# Altium project PCB_Project1.PrjPCB
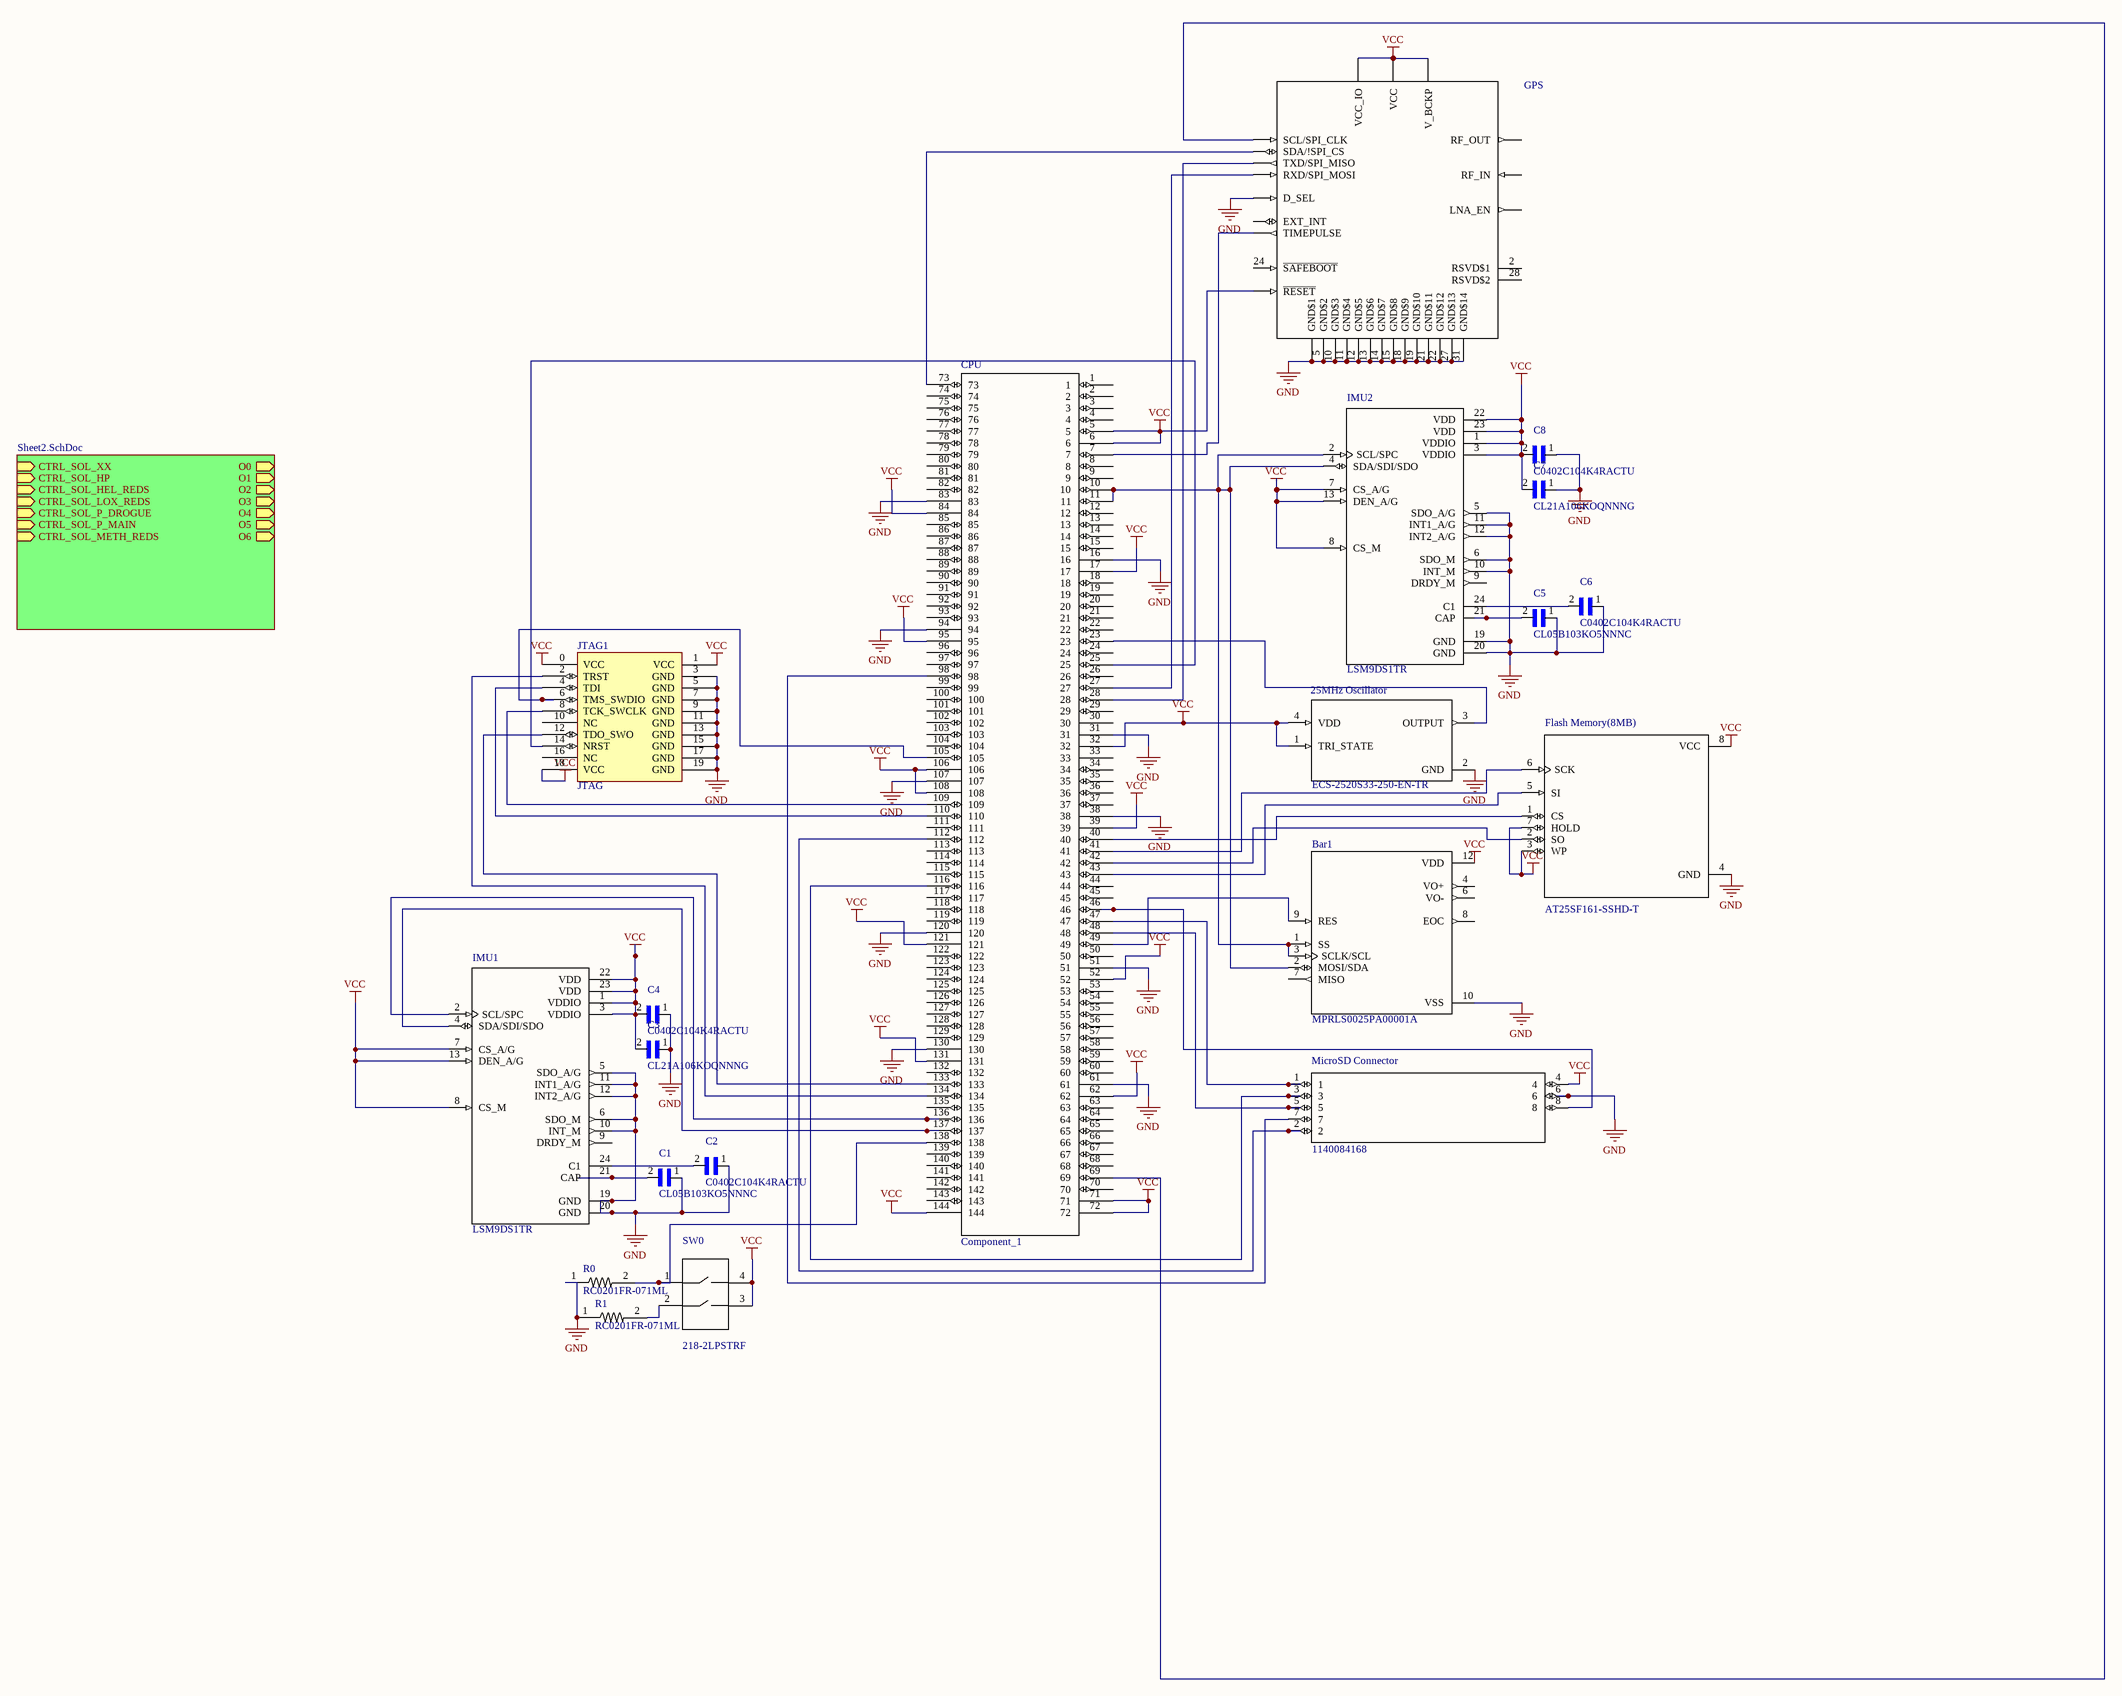
[diagram p0: Sheet1.SchDoc]
1 sheet, 20 parts. Net scope: hierarchical (ports join the sheet entries above them; power ports are global).

## Sheet Sheet1.SchDoc
size C

### Parts
25MHz_Oscillator  ECS-2520S33-250-EN-TR  [*OSC_ECS-2520S33-250-EN-TR]
Bar1  MPRLS0025PA00001A  [*XDCR_MPRLS0025PA00001A]
C1  CL05B103KO5NNNC  [*CAPC1005X55N]
C2  C0402C104K4RACTU  [*CAPC1005X60]
C3  CL21A106KOQNNNG  [*CAPC2012X140N]
C4  C0402C104K4RACTU  [*CAPC1005X60]
C5  CL05B103KO5NNNC  [*CAPC1005X55N]
C6  C0402C104K4RACTU  [*CAPC1005X60]
C7  CL21A106KOQNNNG  [*CAPC2012X140N]
C8  C0402C104K4RACTU  [*CAPC1005X60]
CPU  Component_1  [*QFP50P2200X2200X160-144N]
Flash_Memory(8MB)  AT25SF161-SSHD-T  [*SOIC127P600X175-8N]
GPS  CAM-M8  [*CAM-M8]  (value not drawn)
IMU1  LSM9DS1TR  [*PQFN43P300X350X102-24N]
IMU2  LSM9DS1TR  [*PQFN43P300X350X102-24N]
JTAG1  JTAG  [SBH11-PBPC-D10-ST-BK]
MicroSD_Connector  1140084168  [*1140084168]
R0  RC0201FR-071ML  [*RESC0603X26N]
R1  RC0201FR-071ML  [*RESC0603X26N]
SW0  218-2LPSTRF  [*SW_218-2LPSTRF]

### Sub-sheets
Sheet2.SchDoc = Sheet2.SchDoc (file not in this document): CTRL_SOL_XX (in), CTRL_SOL_HP (in), CTRL_SOL_HEL_REDS (in), CTRL_SOL_LOX_REDS (in), CTRL_SOL_P_DROGUE (in), CTRL_SOL_P_MAIN (in), CTRL_SOL_METH_REDS (in), O0 (out), O1 (out), O2 (out), O3 (out), O4 (out), O5 (out), O6 (out)

### Nets
GND: 25MHz_Oscillator.2(GND) Bar1.10(VSS) C1.1 C2.1 C3.1 C4.1 C5.1 C6.1 C7.1 C8.1 CPU.16 CPU.31 CPU.38 CPU.51 CPU.61 CPU.83 CPU.94 CPU.107 CPU.120 CPU.130 Flash_Memory(8MB).4(GND) GPS.4(GND$1) GPS.5(GND$2) GPS.10(GND$3) GPS.11(GND$4) GPS.12(GND$5) GPS.13(GND$6) GPS.14(GND$7) GPS.15(GND$8) GPS.18(GND$9) GPS.19(GND$10) GPS.20(D_SEL) GPS.21(GND$11) GPS.22(GND$12) GPS.27(GND$13) GPS.31(GND$14) IMU1.5(SDO_A/G) IMU1.6(SDO_M) IMU1.10(INT_M) IMU1.11(INT1_A/G) IMU1.12(INT2_A/G) IMU1.19(GND) IMU1.20(GND) IMU2.5(SDO_A/G) IMU2.6(SDO_M) IMU2.10(INT_M) IMU2.11(INT1_A/G) IMU2.12(INT2_A/G) IMU2.19(GND) IMU2.20(GND) JTAG1.3(GND) JTAG1.5(GND) JTAG1.7(GND) JTAG1.9(GND) JTAG1.11(GND) JTAG1.13(GND) JTAG1.15(GND) JTAG1.17(GND) JTAG1.19(GND) MicroSD_Connector.6 R0.1 R1.1
VCC: 25MHz_Oscillator.1(TRI_STATE) 25MHz_Oscillator.4(VDD) Bar1.12(VDD) C3.2 C4.2 C7.2 C8.2 CPU.5 CPU.6 CPU.17 CPU.32 CPU.39 CPU.52 CPU.62 CPU.71 CPU.72 CPU.84 CPU.95 CPU.106 CPU.108 CPU.121 CPU.131 CPU.144 Flash_Memory(8MB).3(WP) Flash_Memory(8MB).7(HOLD) Flash_Memory(8MB).8(VCC) GPS.1(VCC_IO) GPS.8(V_BCKP) GPS.9(VCC) GPS.23(~{RESET}) IMU1.1(VDDIO) IMU1.3(VDDIO) IMU1.7(CS_A/G) IMU1.8(CS_M) IMU1.13(DEN_A/G) IMU1.22(VDD) IMU1.23(VDD) IMU2.1(VDDIO) IMU2.3(VDDIO) IMU2.7(CS_A/G) IMU2.8(CS_M) IMU2.13(DEN_A/G) IMU2.22(VDD) IMU2.23(VDD) JTAG1.0(VCC) JTAG1.1(VCC) JTAG1.18(VCC) MicroSD_Connector.4 SW0.3 SW0.4
Net25MHz_Oscillator_3: 25MHz_Oscillator.3(OUTPUT) CPU.23
NetBar1_1: Bar1.1(SS) Bar1.2(MOSI/SDA) Bar1.3(SCLK/SCL) CPU.10 CPU.11 IMU2.2(SCL/SPC) IMU2.4(SDA/SDI/SDO)
NetBar1_9: Bar1.9(RES) CPU.49
NetC1_2: C1.2 IMU1.21(CAP)
NetC2_2: C2.2 IMU1.24(C1)
NetC5_2: C5.2 IMU2.21(CAP)
NetC6_2: C6.2 IMU2.24(C1)
NetCPU_7: CPU.7 GPS.29(TIMEPULSE)
NetCPU_25: CPU.25 JTAG1.14(NRST)
NetCPU_27: CPU.27 GPS.26(RXD/SPI_MOSI)
NetCPU_28: CPU.28 GPS.25(TXD/SPI_MISO)
NetCPU_40: CPU.40 Flash_Memory(8MB).1(CS)
NetCPU_41: CPU.41 Flash_Memory(8MB).6(SCK)
NetCPU_42: CPU.42 Flash_Memory(8MB).2(SO)
NetCPU_43: CPU.43 Flash_Memory(8MB).5(SI)
NetCPU_46: CPU.46 MicroSD_Connector.8
NetCPU_47: CPU.47 MicroSD_Connector.1
NetCPU_48: CPU.48 MicroSD_Connector.5
NetCPU_69: CPU.69 GPS.6(SCL/SPI_CLK)
NetCPU_73: CPU.73 GPS.3(SDA/!SPI_CS)
NetCPU_98: CPU.98 MicroSD_Connector.7
NetCPU_105: CPU.105 JTAG1.6(TMS_SWDIO)
NetCPU_109: CPU.109 JTAG1.8(TCK_SWCLK)
NetCPU_110: CPU.110 JTAG1.4(TDI)
NetCPU_112: CPU.112 MicroSD_Connector.2
NetCPU_116: CPU.116 MicroSD_Connector.3
NetCPU_133: CPU.133 JTAG1.12(TDO_SWO)
NetCPU_134: CPU.134 JTAG1.2(TRST)
NetCPU_136: CPU.136 IMU1.2(SCL/SPC)
NetCPU_137: CPU.137 IMU1.4(SDA/SDI/SDO)
NetCPU_138: CPU.138 R0.2 SW0.1
NetR1_2: R1.2 SW0.2

Not connected (* = marked no-connect by the designer): Bar1 4(VO+) 6(VO-) 7(MISO) 8(EOC); CPU 1 2 3 4 8 9 12 13 14 15 18 19 20 21 22 24 26 29 30 33 34 35 36 37 44 45 50 53 54 55 56 57 58 59 60 63 64 65 66 67 68 70 74 75 76 77 78 79 80 81 82 85 86 87 88 89 90 91 92 93 96 97 99 100 101 102 103 104 111 113 114 115 117 118 119 122 123 124 125 126 127 128 129 132 135 139 140 141 142 143; GPS 2(RSVD$1) 7(EXT_INT) 16(RF_OUT) 17(RF_IN) 24(~{SAFEBOOT}) 28(RSVD$2) 30(LNA_EN); IMU1 9(DRDY_M); IMU2 9(DRDY_M); JTAG1 10(NC) 16(NC)

### Library data of the parts
25MHz_Oscillator = ECS-2520S33-250-EN-TR: / Miniature Crystal Oscillator HCMOS Tight Stability 3.3V 25MHz Â±15ppm -40 to 85Â°C 2.5x2x0.9mm SMD T/R /; MF: ECS Inc.; SnapEDA_Link: https://www.snapeda.com/parts/ECS-2520S33-250-EN-TR/ECS%20Inc./view-part/?ref=snap; MP: ECS-2520S33-250-EN-TR; Availability: Unavailable; Price: None; Package: SMD-4 ECS International; Value: *
Bar1 = MPRLS0025PA00001A: Pressure Sensor 0psi to 25psi Absolute 12-Pin T/R; MF: Honeywell Sensing; Price: None; Package: SMD-10 Honeywell; SnapEDA_Link: https://www.snapeda.com/parts/MPRLS0025PA00001A/Honeywell%20Sensing%20and%20Productivity%20Solutions/view-part/?ref=snap; Availability: Unavailable; MP: MPRLS0025PA00001A; Value: *
C1 C5 = CL05B103KO5NNNC: / CL05 Series 10 nF 16 V Â±10 % Tolerance X7R SMT Multilayer Ceramic Capacitor /; MF: Samsung Electro-Mechanics; Availability: Unavailable; Price: None; MP: CL05B103KO5NNNC; Package: 0402 Samsung; SnapEDA_Link: https://www.snapeda.com/parts/CL05B103KO5NNNC/Samsung%20Electro-Mechanics/view-part/?ref=snap; Value: *
C2 C4 C6 C8 = C0402C104K4RACTU: Capacitor; Ceramic; Cap; .100uF; Tol 10%; SMT; Vol-Rtg 16V; X7R; Tape And Reel; MF: KEMET; SnapEDA_Link: https://www.snapeda.com/parts/C0402C104K4RACTU/KEMET/view-part/?ref=snap; MP: C0402C104K4RACTU; Availability: Unavailable; Package: 0402 Kemet; Price: None; Value: *
C3 C7 = CL21A106KOQNNNG: CAP CER 10UF 16V X5R 0805; MF: Samsung Electro-Mechanics; SnapEDA_Link: https://www.snapeda.com/parts/CL21A106KOQNNNG/Samsung%20Electro-Mechanics/view-part/?ref=snap; Digi-Key_Purchase_URL: https://www.digikey.com/product-detail/en/samsung-electro-mechanics/CL21A106KOQNNNG/1276-6455-1-ND/5958083?utm_source=snapeda&utm_medium=aggregator&utm_campaign=symbol; MP: CL21A106KOQNNNG; Package: 0805 Samsung Electro-Mechanics; Digi-Key_Part_Number: 1276-6455-1-ND; Value: *
Flash_Memory(8MB) = AT25SF161-SSHD-T: NOR Flash Serial-SPI 3.3V 16Mbit 16M x 1Bit 8ns 8-Pin SOIC T/R; MF: Adesto Technologies; Package: SOIC-8 Adesto Technologies; Price: None; MP: AT25SF161-SSHD-T; Availability: Unavailable; SnapEDA_Link: https://www.snapeda.com/parts/AT25SF161-SSHD-T/Adesto%20Technologies/view-part/?ref=snap; Value: *
GPS = CAM-M8: Repl. Leica M8 14464; MF: Dantona Industries; Price: None; MP: CAM-M8; SnapEDA_Link: https://www.snapeda.com/parts/CAM-M8/Dantona%20Industries/view-part/?ref=snap; Availability: Unavailable; Package: None; Value: *
IMU1 IMU2 = LSM9DS1TR: / LSM9DS1 Series Â±2/Â±4/Â±8/Â±16 g 3D Digital Linear Acceleration Sensor - LGA-24 /; MF: STMicroelectronics; Availability: Unavailable; Price: None; MP: LSM9DS1TR; Package: TFLGA-24 STMicroelectronics; SnapEDA_Link: https://www.snapeda.com/parts/LSM9DS1TR/STMicroelectronics/view-part/?ref=snap; Value: *
JTAG1 = SBH11-PBPC-D10-ST-BK: JTAG connector for connection wiht ST-LINK/V2 connector(CN3); pin to pad: 1>0
MicroSD_Connector = 1140084168: Memory Card Connector, Microsd, 8 Position, Full Reel; MF: Amphenol ICC; MP: 114-00841-68; Availability: Unavailable; Price: None; Package: None; SnapEDA_Link: https://www.snapeda.com/parts/114-00841-68/Amphenol%20ICC/view-part/?ref=snap; Value: *
R0 R1 = RC0201FR-071ML: Surface Mount Chip Resistor, Thick Film, RC Series, 1 Mohm, 50 mW, 1%, 0201 [0603 Metric]; MF: Yageo; Package: 0201 Yageo; Price: None; MP: RC0201FR-071ML; Availability: Unavailable; SnapEDA_Link: https://www.snapeda.com/parts/RC0201FR-071ML/Yageo/view-part/?ref=snap; Value: *
SW0 = 218-2LPSTRF: Switch DIP OFF ON SPST 2 Recessed Slide 0.025A 24VDC Gull Wing SMD T/R; MF: CTS Electrocomponents; Package: None; MP: 218-2LPSTRF; Availability: Unavailable; Price: None; SnapEDA_Link: https://www.snapeda.com/parts/218-2LPSTRF/CTS%20Electrocomponents/view-part/?ref=snap; Value: *